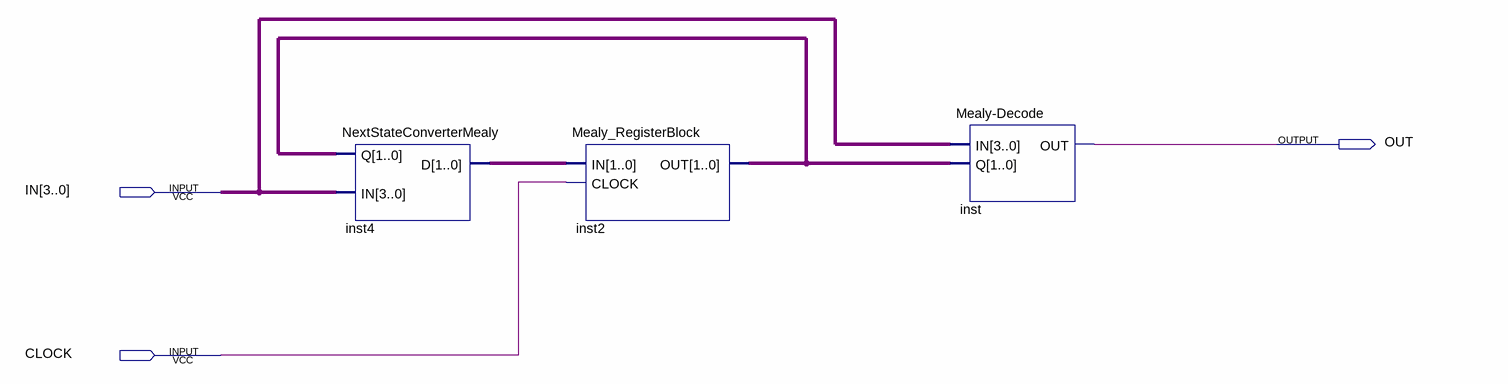
[diagram p0: schematic sheet]
// Quartus schematic Mealy.bdf as structural Verilog: 3 symbols, 3 pins
module Mealy (
  input  [3:0] IN,
  input  CLOCK,
  output OUT
);

  wire [1:0] inst2_out, inst4_d;

  NextStateConverterMealy inst4 (.IN(IN), .Q(inst2_out), .D(inst4_d));
  Mealy_RegisterBlock inst2 (.IN(inst4_d), .CLOCK(CLOCK), .OUT(inst2_out));
  \Mealy-Decode  inst (.IN(IN), .Q(inst2_out), .OUT(OUT));
endmodule
